# Altium schematic sheet micro_schematic.SchDoc
size B
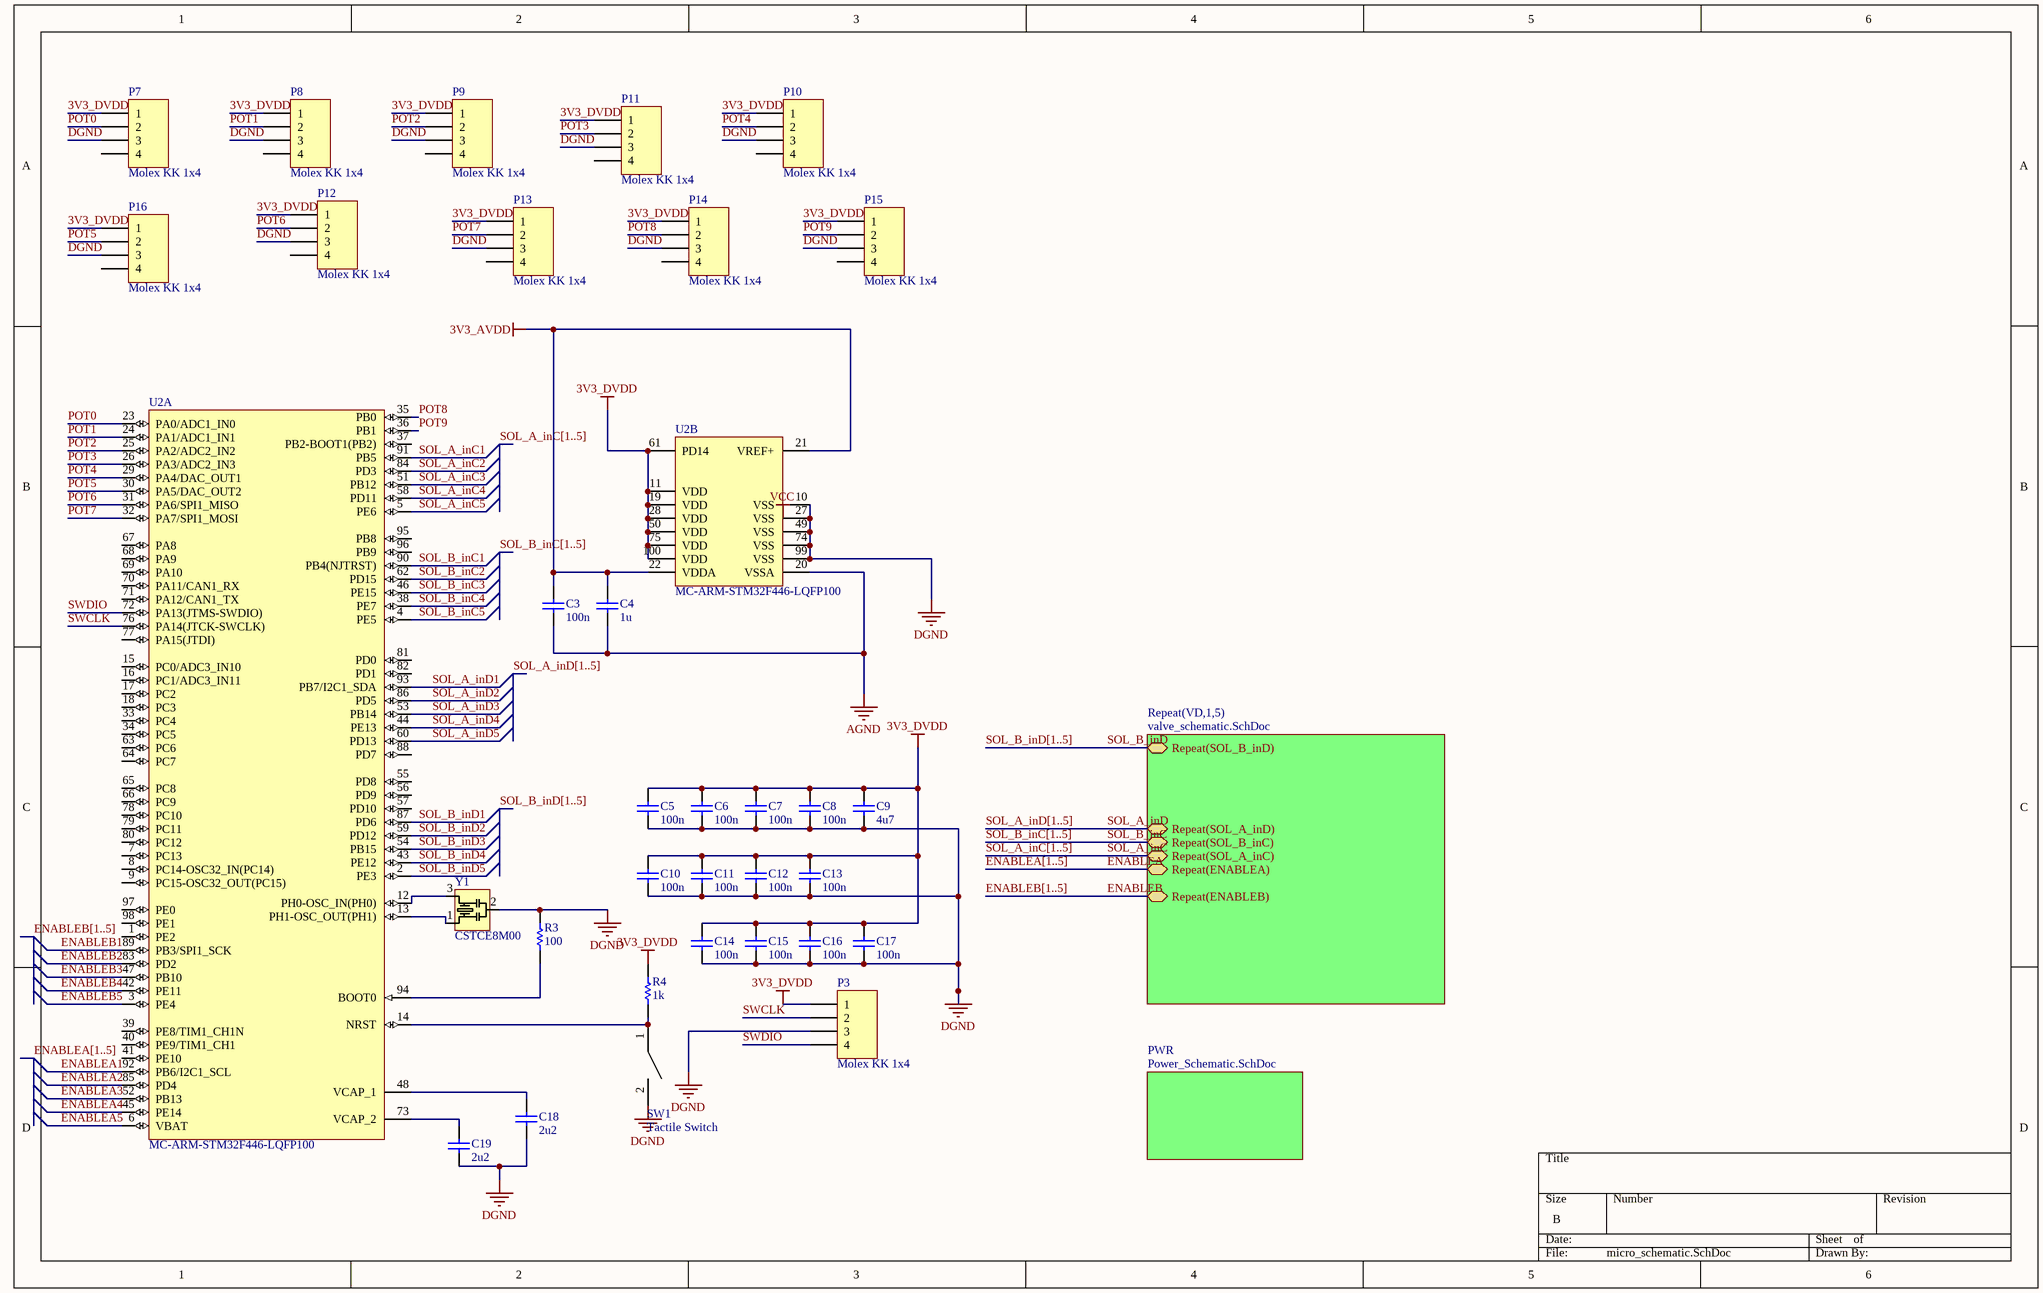
[diagram p0: micro_schematic.SchDoc]

## Parts
C3  100n  [C0603]
C4  1u  [C0603]
C5  100n  [C0805]
C6  100n  [C0805]
C7  100n  [C0805]
C8  100n  [C0805]
C9  4u7  [C0805]
C10  100n  [C0805]
C11  100n  [C0805]
C12  100n  [C0805]
C13  100n  [C0805]
C14  100n  [C0805]
C15  100n  [C0805]
C16  100n  [C0805]
C17  100n  [C0805]
C18  2u2  [C0603]
C19  2u2  [C0603]
P3  Molex KK 1x4  [Molex KK 4x1]
P7  Molex KK 1x4  [Molex KK 4x1]
P8  Molex KK 1x4  [Molex KK 4x1]
P9  Molex KK 1x4  [Molex KK 4x1]
P10  Molex KK 1x4  [Molex KK 4x1]
P11  Molex KK 1x4  [Molex KK 4x1]
P12  Molex KK 1x4  [Molex KK 4x1]
P13  Molex KK 1x4  [Molex KK 4x1]
P14  Molex KK 1x4  [Molex KK 4x1]
P15  Molex KK 1x4  [Molex KK 4x1]
P16  Molex KK 1x4  [Molex KK 4x1]
R3  100  [R0805]
R4  1k  [R0805]
SW1  Tactile Switch  [Tactile Switch]
U2  MC-ARM-STM32F446-LQFP100  [STM-LQFP100_N]  (parts A,B of 2)
Y1  CSTCE8M00  [8MHz Ceramic Resonator]

## Sub-sheets
PWR = Power_Schematic.SchDoc: no entries
Repeat(VD,1,5) = valve_schematic.SchDoc: Repeat(SOL_B_inD), Repeat(SOL_A_inD), Repeat(SOL_B_inC), Repeat(SOL_A_inC), Repeat(ENABLEA), Repeat(ENABLEB)

## Nets
3V3_AVDD: C3.1 C4.1 U2.21(VREF+) U2.22(VDDA)
3V3_DVDD: C5.1 C6.1 C7.1 C8.1 C9.1 C10.1 C11.1 C12.1 C13.1 C14.1 C15.1 C16.1 C17.1 P3.1 P7.1 P8.1 P9.1 P10.1 P11.1 P12.1 P13.1 P14.1 P15.1 P16.1 R4.2 U2.11(VDD) U2.19(VDD) U2.28(VDD) U2.50(VDD) U2.61(PD14) U2.75(VDD) U2.100(VDD)
AGND: C3.2 C4.2 U2.20(VSSA)
DGND: C5.2 C6.2 C7.2 C8.2 C9.2 C10.2 C11.2 C12.2 C13.2 C14.2 C15.2 C16.2 C17.2 C18.2 C19.2 P3.3 P7.3 P8.3 P9.3 P10.3 P11.3 P12.3 P13.3 P14.3 P15.3 P16.3 R3.2 U2.10(VSS) U2.27(VSS) U2.49(VSS) U2.74(VSS) U2.99(VSS) Y1.2(GND)
ENABLEA: sheet Repeat(VD,1,5)/Repeat(ENABLEA)
ENABLEA1: U2.92(PB6/I2C1_SCL)
ENABLEA2: U2.85(PD4)
ENABLEA3: U2.52(PB13)
ENABLEA4: U2.45(PE14)
ENABLEA5: U2.6(VBAT)
ENABLEB: sheet Repeat(VD,1,5)/Repeat(ENABLEB)
ENABLEB1: U2.89(PB3/SPI1_SCK)
ENABLEB2: U2.83(PD2)
ENABLEB3: U2.47(PB10)
ENABLEB4: U2.42(PE11)
ENABLEB5: U2.3(PE4)
POT0: P7.2 U2.23(PA0/ADC1_IN0)
POT1: P8.2 U2.24(PA1/ADC1_IN1)
POT2: P9.2 U2.25(PA2/ADC2_IN2)
POT3: P11.2 U2.26(PA3/ADC2_IN3)
POT4: P10.2 U2.29(PA4/DAC_OUT1)
POT5: P16.2 U2.30(PA5/DAC_OUT2)
POT6: P12.2 U2.31(PA6/SPI1_MISO)
POT7: P13.2 U2.32(PA7/SPI1_MOSI)
POT8: P14.2 U2.35(PB0)
POT9: P15.2 U2.36(PB1)
SOL_A_inC: sheet Repeat(VD,1,5)/Repeat(SOL_A_inC)
SOL_A_inC1: U2.91(PB5)
SOL_A_inC2: U2.84(PD3)
SOL_A_inC3: U2.51(PB12)
SOL_A_inC4: U2.58(PD11)
SOL_A_inC5: U2.5(PE6)
SOL_A_inD: sheet Repeat(VD,1,5)/Repeat(SOL_A_inD)
SOL_A_inD1: U2.93(PB7/I2C1_SDA)
SOL_A_inD2: U2.86(PD5)
SOL_A_inD3: U2.53(PB14)
SOL_A_inD4: U2.44(PE13)
SOL_A_inD5: U2.60(PD13)
SOL_B_inC: sheet Repeat(VD,1,5)/Repeat(SOL_B_inC)
SOL_B_inC1: U2.90(PB4(NJTRST))
SOL_B_inC2: U2.62(PD15)
SOL_B_inC3: U2.46(PE15)
SOL_B_inC4: U2.38(PE7)
SOL_B_inC5: U2.4(PE5)
SOL_B_inD: sheet Repeat(VD,1,5)/Repeat(SOL_B_inD)
SOL_B_inD1: U2.87(PD6)
SOL_B_inD2: U2.59(PD12)
SOL_B_inD3: U2.54(PB15)
SOL_B_inD4: U2.43(PE12)
SOL_B_inD5: U2.2(PE3)
SWCLK: P3.2 U2.76(PA14(JTCK-SWCLK))
SWDIO: P3.4 U2.72(PA13(JTMS-SWDIO))
NetC18_1: C18.1 U2.48(VCAP_1)
NetC19_1: C19.1 U2.73(VCAP_2)
NetR3_1: R3.1 U2.94(BOOT0)
NetR4_1: R4.1 SW1.1 U2.14(NRST)
NetU2_12: U2.12(PH0-OSC_IN(PH0)) Y1.3(OSC2)
NetU2_13: U2.13(PH1-OSC_OUT(PH1)) Y1.1(OSC1)

Not connected (* = marked no-connect by the designer): P7 4; P8 4; P9 4; P10 4; P11 4; P12 4; P13 4; P14 4; P15 4; P16 4; SW1 2(1); U2 1(PE2) 7(PC13) 8(PC14-OSC32_IN(PC14)) 9(PC15-OSC32_OUT(PC15)) 15(PC0/ADC3_IN10) 16(PC1/ADC3_IN11) 17(PC2) 18(PC3) 33(PC4) 34(PC5) 37(PB2-BOOT1(PB2)) 39(PE8/TIM1_CH1N) 40(PE9/TIM1_CH1) 41(PE10) 55(PD8) 56(PD9) 57(PD10) 63(PC6) 64(PC7) 65(PC8) 66(PC9) 67(PA8) 68(PA9) 69(PA10) 70(PA11/CAN1_RX) 71(PA12/CAN1_TX) 77(PA15(JTDI)) 78(PC10) 79(PC11) 80(PC12) 81(PD0) 82(PD1) 88(PD7) 95(PB8) 96(PB9) 97(PE0) 98(PE1)

## Buses and harness runs
bus ENABLEA[1..5]
bus ENABLEB[1..5]
bus SOL_A_inC[1..5]
bus SOL_A_inD[1..5]
bus SOL_B_inC[1..5]
bus SOL_B_inD[1..5]

## Notes on the sheet
- Labels drawn without touching a wire or pin: DGND, VCC

## Library data of the parts
C3 C4 C18 C19 = C0603: 0603 Capacitor
  C3: Value: 100n
  C4: Value: 1u
  C18 C19: Value: 2u2
C5-C17 = C0805: 0805 Capacitor
  C5-C8 C10-C17: Value: 100n
  C9: Value: 4u7
P3 P7-P16 = Molex KK 1x4: 1x4 Molex KK Connector
R3 R4 = R0805: RESISTOR 0805
  R3: Value: 100
  R4: Value: 1k
SW1 = Tactile Switch: TL3301AF160QG
Y1 = CSTCE8M00: 8MHz Ceramic Resonator